# Altium schematic sheet Voltage_Mearsure_Block.SchDoc
size A4; SheetNumber: 7; SheetTotal: 10
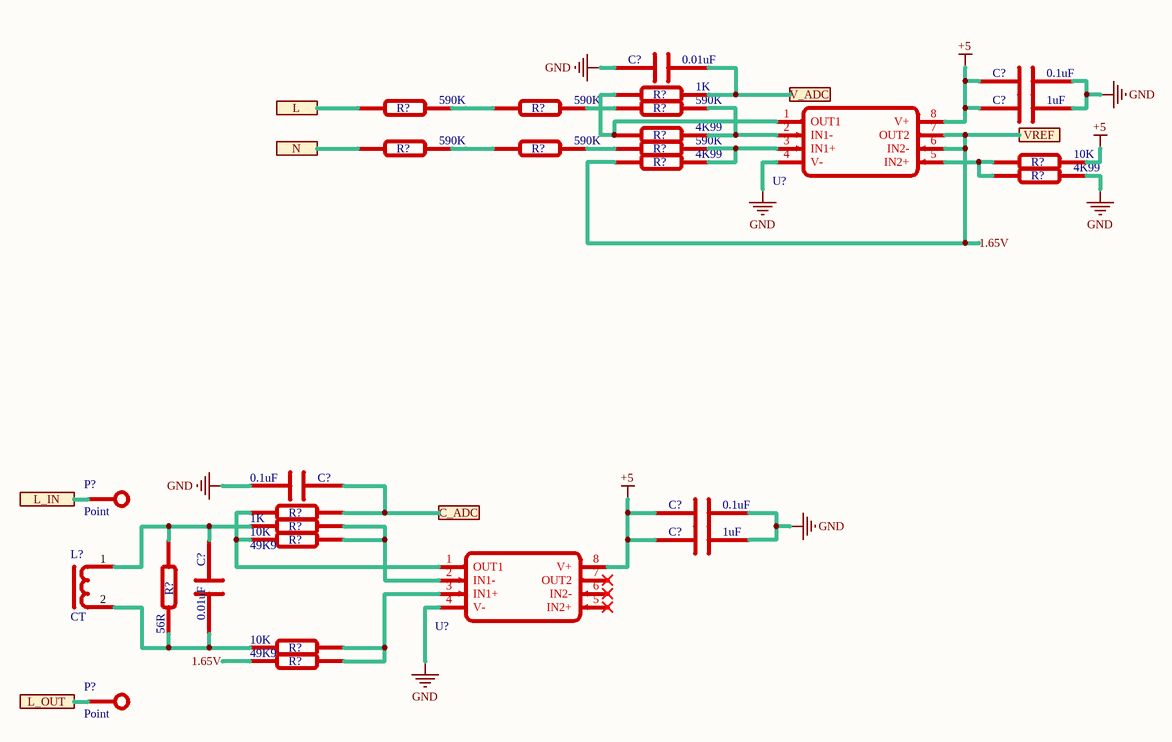
[diagram p0: Voltage_Mearsure_Block.SchDoc]

## Parts
(Parts that share a designator on the sheet are numbered #1, #2 ... from top to bottom, then left to right.)
C?#1  0.01uF  [C0402]
C?#2  0.1uF  [C0402]
C?#3  1uF  [C0402]
C?#4  0.1uF  [C0402]
C?#5  0.1uF  [C0402]
C?#6  1uF  [C0402]
C?#7  0.01uF  [C0402]
L?  CT  [ZMCT103C]
P?#1  Point  [POINT-1.2]
P?#2  Point  [POINT-1.2]
R?#1  1K  [R0805]
R?#2  590K  [R0805]
R?#3  590K  [R0805]
R?#4  590K  [R0805]
R?#5  4K99  [R0805]
R?#6  590K  [R0805]
R?#7  590K  [R0805]
R?#8  590K  [R0805]
R?#9  4K99  [R0805]
R?#10  10K  [R0805]
R?#11  4K99  [R0805]
R?#12  1K  [R0805]
R?#13  10K  [R0805]
R?#14  49K9  [R0805]
R?#15  56R  [R0805]
R?#16  10K  [R0805]
R?#17  49K9  [R0805]
U?#1  LM358  [SOIC-8]  (value not drawn)
U?#2  LM358  [SOIC-8]  (value not drawn)

## Ports
C_ADC, L, L_IN, L_OUT, N, V_ADC, VREF

## Nets
+5: C?#2.1 C?#3.1 C?#5.1 C?#6.1 R?#10.2 U?#1.8(V+) U?#2.8(V+)
GND: C?#1.1 C?#2.2 C?#3.2 C?#4.2 C?#5.2 C?#6.2 R?#11.2 U?#1.4(V-) U?#2.4(V-)
1.65V: R?#9.1 R?#17.2 U?#1.6(IN2-) U?#1.7(OUT2) ; port VREF
C_ADC: C?#4.1 R?#12.1 ; port C_ADC
L: R?#2.1 ; port L
L_IN: P?#1.1 ; port L_IN
L_OUT: P?#2.1 ; port L_OUT
N: R?#6.1 ; port N
V_ADC: C?#1.2 R?#1.2 ; port V_ADC
NetC?#7_1: C?#7.1 L?.2 R?#15.1 R?#16.2
NetC?#7_2: C?#7.2 L?.1 R?#13.2 R?#15.2
NetR?#1_1: R?#1.1 R?#5.1 U?#1.1(OUT1)
NetR?#2_2: R?#2.2 R?#3.1
NetR?#3_2: R?#3.2 R?#4.1
NetR?#4_2: R?#4.2 R?#5.2 U?#1.2(IN1-)
NetR?#6_2: R?#6.2 R?#7.1
NetR?#7_2: R?#7.2 R?#8.1
NetR?#8_2: R?#8.2 R?#9.2 U?#1.3(IN1+)
NetR?#10_1: R?#10.1 R?#11.1 U?#1.5(IN2+)
NetR?#12_2: R?#12.2 R?#14.2 U?#2.1(OUT1)
NetR?#13_1: R?#13.1 R?#14.1 U?#2.2(IN1-)
NetR?#16_1: R?#16.1 R?#17.1 U?#2.3(IN1+)

Not connected (* = marked no-connect by the designer): U?#2 5(IN2+)* 6(IN2-)* 7(OUT2)*

## Notes on the sheet
- Title
- Size:
- Date:
- A4
- Number:
- Time:
- Revision:
- Design by:
- Company:
- File:

## Library data of the parts
C?#1-C?#7 = CAP-CER: Ceramic Capacitor
L? = CT: Current Transformer
P?#1 P?#2 = Point: Wire Pin
R?#1-R?#17 = Resistor
U?#1 U?#2 = LM358: Low-power dual Operational Amplifier; ComponentLink1Description: LM358M Datasheets; ComponentLink1URL: https://www.ti.com/general/docs/suppproductinfo.tsp?distId=10&gotoUrl=https%3A%2F%2Fwww.ti.com%2Flit%2Fgpn%2Flm158-n